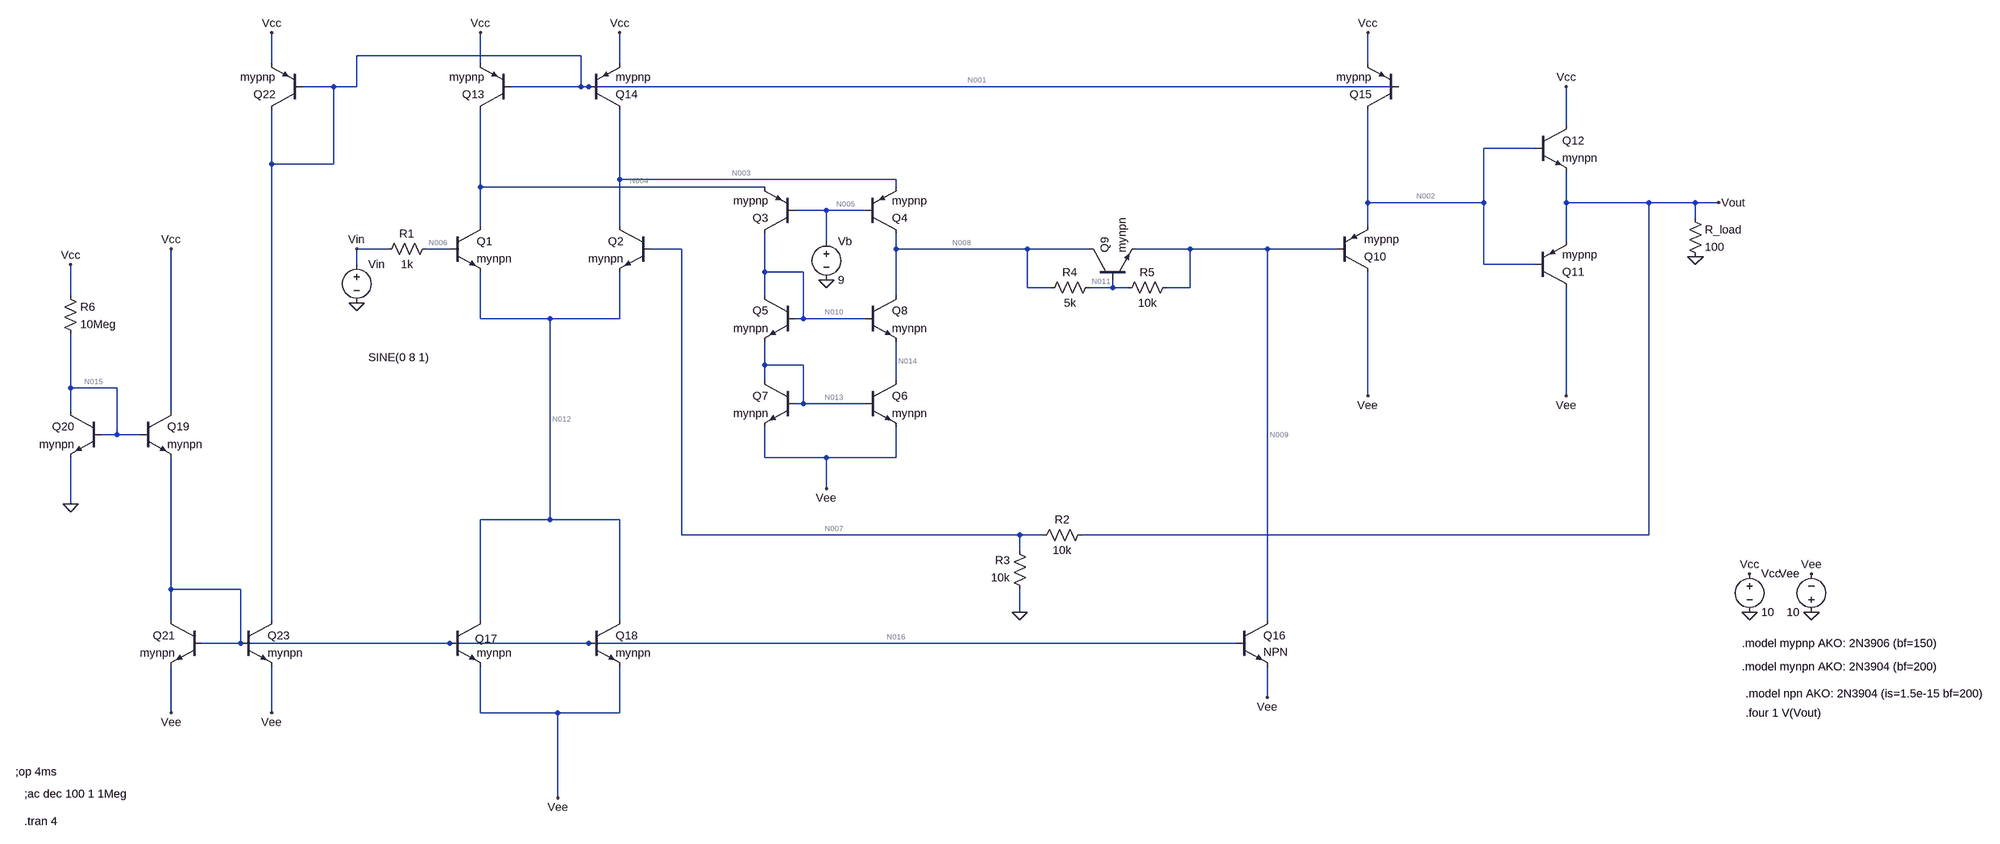
[diagram p0: schematic elec2_5.asc]
elec2_5.asc, the LTspice schematic file:
Version 4
SHEET 1 3028 1544
WIRE -48 -80 -512 -80
WIRE -688 -64 -688 -128
WIRE -256 -64 -256 -128
WIRE 32 -64 32 -128
WIRE 1648 -64 1648 -128
WIRE -560 -16 -624 -16
WIRE -512 -16 -512 -80
WIRE -512 -16 -560 -16
WIRE -48 -16 -48 -80
WIRE -48 -16 -192 -16
WIRE -32 -16 -48 -16
WIRE 1712 -16 -32 -16
WIRE 2112 64 2112 -16
WIRE 2048 112 1888 112
WIRE -688 144 -688 32
WIRE -560 144 -560 -16
WIRE -560 144 -688 144
WIRE 32 176 32 32
WIRE 672 176 32 176
WIRE -256 192 -256 32
WIRE 400 192 -256 192
WIRE 672 192 672 176
WIRE 1648 224 1648 32
WIRE 1888 224 1888 112
WIRE 1888 224 1648 224
WIRE 2112 224 2112 160
WIRE 2288 224 2112 224
WIRE 2384 224 2288 224
WIRE 2432 224 2384 224
WIRE 528 240 464 240
WIRE 608 240 528 240
WIRE 2384 256 2384 224
WIRE -256 272 -256 192
WIRE 32 272 32 176
WIRE 1648 272 1648 224
WIRE 528 304 528 240
WIRE 2112 304 2112 224
WIRE -448 320 -512 320
WIRE -320 320 -368 320
WIRE 160 320 96 320
WIRE 672 320 672 288
WIRE 944 320 672 320
WIRE 1072 320 944 320
WIRE 1280 320 1168 320
WIRE 1440 320 1280 320
WIRE 1584 320 1440 320
WIRE -512 352 -512 320
WIRE 1888 352 1888 224
WIRE 2048 352 1888 352
WIRE 400 368 400 288
WIRE 480 368 400 368
WIRE 944 400 944 320
WIRE 992 400 944 400
WIRE 1120 400 1120 384
WIRE 1120 400 1072 400
WIRE 1152 400 1120 400
WIRE 1280 400 1280 320
WIRE 1280 400 1232 400
WIRE -1104 416 -1104 352
WIRE 400 416 400 368
WIRE 672 416 672 320
WIRE -256 464 -256 368
WIRE -112 464 -256 464
WIRE 32 464 32 368
WIRE 32 464 -112 464
WIRE 480 464 480 368
WIRE 480 464 464 464
WIRE 608 464 480 464
WIRE 400 560 400 512
WIRE 480 560 400 560
WIRE 400 592 400 560
WIRE 672 592 672 512
WIRE -1104 608 -1104 496
WIRE -1008 608 -1104 608
WIRE 1648 624 1648 368
WIRE 2112 624 2112 400
WIRE 480 640 480 560
WIRE 480 640 464 640
WIRE 608 640 480 640
WIRE -1104 656 -1104 608
WIRE -896 656 -896 320
WIRE -1008 704 -1008 608
WIRE -1008 704 -1040 704
WIRE -960 704 -1008 704
WIRE 400 752 400 688
WIRE 528 752 400 752
WIRE 672 752 672 688
WIRE 672 752 528 752
WIRE 528 816 528 752
WIRE -1104 848 -1104 752
WIRE -112 880 -112 464
WIRE -112 880 -256 880
WIRE 32 880 -112 880
WIRE 160 912 160 320
WIRE 928 912 160 912
WIRE 976 912 928 912
WIRE 2288 912 2288 224
WIRE 2288 912 1056 912
WIRE 928 944 928 912
WIRE -896 1024 -896 752
WIRE -752 1024 -896 1024
WIRE 928 1072 928 1024
WIRE -896 1088 -896 1024
WIRE -688 1088 -688 144
WIRE -256 1088 -256 880
WIRE 32 1088 32 880
WIRE 1440 1088 1440 320
WIRE -752 1136 -752 1024
WIRE -752 1136 -832 1136
WIRE -320 1136 -752 1136
WIRE -32 1136 -320 1136
WIRE 1376 1136 -32 1136
WIRE 1440 1248 1440 1184
WIRE -896 1280 -896 1184
WIRE -688 1280 -688 1184
WIRE -256 1280 -256 1184
WIRE -96 1280 -256 1280
WIRE 32 1280 32 1184
WIRE 32 1280 -96 1280
WIRE -96 1456 -96 1280
FLAG 2496 1072 0
FLAG 2496 992 Vcc
FLAG -256 -128 Vcc
FLAG 32 -128 Vcc
FLAG 2624 1072 0
FLAG 2624 992 Vee
FLAG -96 1456 Vee
FLAG 528 384 0
FLAG 528 816 Vee
FLAG -512 432 0
FLAG 928 1072 0
FLAG 2112 624 Vee
FLAG 2112 -16 Vcc
FLAG 2384 336 0
FLAG 2432 224 Vout
FLAG 1648 624 Vee
FLAG 1648 -128 Vcc
FLAG 1440 1248 Vee
FLAG -896 1280 Vee
FLAG -688 -128 Vcc
FLAG -512 320 Vin
FLAG -688 1280 Vee
FLAG -1104 848 0
FLAG -896 320 Vcc
FLAG -1104 352 Vcc
SYMBOL voltage 2496 976 R0
WINDOW 123 0 0 Left 0
WINDOW 39 0 0 Left 0
SYMATTR InstName Vcc
SYMATTR Value 10
SYMBOL voltage -512 336 R0
WINDOW 3 24 208 Left 2
WINDOW 123 24 180 Left 2
WINDOW 39 0 0 Left 0
SYMATTR InstName Vin
SYMATTR Value SINE(0 8 1)
SYMBOL npn -320 272 R0
SYMATTR InstName Q1
SYMATTR Value mynpn
SYMBOL npn 96 272 M0
SYMATTR InstName Q2
SYMATTR Value mynpn
SYMBOL voltage 2624 1088 R180
WINDOW 0 24 96 Left 2
WINDOW 3 24 16 Left 2
WINDOW 123 0 0 Left 0
WINDOW 39 0 0 Left 0
SYMATTR InstName Vee
SYMATTR Value 10
SYMBOL pnp 464 288 R180
SYMATTR InstName Q3
SYMATTR Value mypnp
SYMBOL pnp 608 288 M180
SYMATTR InstName Q4
SYMATTR Value mypnp
SYMBOL voltage 528 288 R0
WINDOW 123 0 0 Left 0
WINDOW 39 0 0 Left 0
SYMATTR InstName Vb
SYMATTR Value 9
SYMBOL npn 464 416 M0
SYMATTR InstName Q5
SYMATTR Value mynpn
SYMBOL npn 608 592 R0
SYMATTR InstName Q6
SYMATTR Value mynpn
SYMBOL npn 464 592 M0
SYMATTR InstName Q7
SYMATTR Value mynpn
SYMBOL res -352 304 R90
WINDOW 0 0 56 VBottom 2
WINDOW 3 32 56 VTop 2
SYMATTR InstName R1
SYMATTR Value 1k
SYMBOL npn 608 416 R0
SYMATTR InstName Q8
SYMATTR Value mynpn
SYMBOL res 1072 896 R90
WINDOW 0 0 56 VBottom 2
WINDOW 3 32 56 VTop 2
SYMATTR InstName R2
SYMATTR Value 10k
SYMBOL res 944 1040 R180
WINDOW 0 36 76 Left 2
WINDOW 3 36 40 Left 2
SYMATTR InstName R3
SYMATTR Value 10k
SYMBOL res 1088 384 R90
WINDOW 0 0 56 VBottom 2
WINDOW 3 32 56 VTop 2
SYMATTR InstName R4
SYMATTR Value 5k
SYMBOL res 1248 384 R90
WINDOW 0 0 56 VBottom 2
WINDOW 3 32 56 VTop 2
SYMATTR InstName R5
SYMATTR Value 10k
SYMBOL npn 1072 384 R270
SYMATTR InstName Q9
SYMATTR Value mynpn
SYMBOL pnp 1584 368 M180
SYMATTR InstName Q10
SYMATTR Value mypnp
SYMBOL pnp 2048 400 M180
SYMATTR InstName Q11
SYMATTR Value mypnp
SYMBOL npn 2048 64 R0
SYMATTR InstName Q12
SYMATTR Value mynpn
SYMBOL res 2368 240 R0
SYMATTR InstName R_load
SYMATTR Value 100
SYMBOL pnp -192 32 R180
SYMATTR InstName Q13
SYMATTR Value mypnp
SYMBOL pnp -32 32 M180
SYMATTR InstName Q14
SYMATTR Value mypnp
SYMBOL pnp 1712 32 R180
SYMATTR InstName Q15
SYMATTR Value mypnp
SYMBOL npn 1376 1088 R0
WINDOW 3 56 66 Left 2
SYMATTR InstName Q16
SYMBOL npn -320 1088 R0
WINDOW 0 53 39 Left 2
SYMATTR InstName Q17
SYMATTR Value mynpn
SYMBOL npn -832 1088 M0
SYMATTR InstName Q21
SYMATTR Value mynpn
SYMBOL pnp -624 32 R180
SYMATTR InstName Q22
SYMATTR Value mypnp
SYMBOL npn -752 1088 R0
SYMATTR InstName Q23
SYMATTR Value mynpn
SYMBOL npn -32 1088 R0
SYMATTR InstName Q18
SYMATTR Value mynpn
SYMBOL res -1120 400 R0
SYMATTR InstName R6
SYMATTR Value 10Meg
SYMBOL npn -960 656 R0
SYMATTR InstName Q19
SYMATTR Value mynpn
SYMBOL npn -1040 656 M0
SYMATTR InstName Q20
SYMATTR Value mynpn
TEXT 2480 1136 Left 2 !.model mypnp AKO: 2N3906 (bf=150)
TEXT 2480 1184 Left 2 !.model mynpn AKO: 2N3904 (bf=200)
TEXT -1218 1402 Left 2 !;op 4ms
TEXT -1200 1448 Left 2 !;ac dec 100 1 1Meg
TEXT -1200 1504 Left 2 !.tran 4
TEXT 2488 1240 Left 2 !.model npn AKO: 2N3904 (is=1.5e-15 bf=200)
TEXT 2488 1280 Left 2 !.four 1 V(Vout)

The netlist it stands for:
* elec2_5.asc
Vcc Vcc 0 10
Vin Vin 0 SINE(0 8 1)
Q1 N004 N006 N012 0 mynpn
Q2 N003 N007 N012 0 mynpn
Vee 0 Vee 10
Q3 N010 N005 N004 0 mypnp
Q4 N008 N005 N003 0 mypnp
Vb N005 0 9
Q5 N010 N010 N013 0 mynpn
Q6 N014 N013 Vee 0 mynpn
Q7 N013 N013 Vee 0 mynpn
R1 N006 Vin 1k
Q8 N008 N010 N014 0 mynpn
R2 Vout N007 10k
R3 0 N007 10k
R4 N011 N008 5k
R5 N009 N011 10k
Q9 N008 N011 N009 0 mynpn
Q10 Vee N009 N002 0 mypnp
Q11 Vee N002 Vout 0 mypnp
Q12 Vcc N002 Vout 0 mynpn
R_load Vout 0 100
Q13 N004 N001 Vcc 0 mypnp
Q14 N003 N001 Vcc 0 mypnp
Q15 N002 N001 Vcc 0 mypnp
Q16 N009 N016 Vee 0 NPN
Q17 N012 N016 Vee 0 mynpn
Q21 N016 N016 Vee 0 mynpn
Q22 N001 N001 Vcc 0 mypnp
Q23 N001 N016 Vee 0 mynpn
Q18 N012 N016 Vee 0 mynpn
R6 Vcc N015 10Meg
Q19 Vcc N015 N016 0 mynpn
Q20 N015 N015 0 0 mynpn
.model NPN NPN
.model PNP PNP
.lib standard.bjt
.model mypnp AKO: 2N3906 (bf=150)
.model mynpn AKO: 2N3904 (bf=200)
;op 4ms
;ac dec 100 1 1Meg
.tran 4
.model npn AKO: 2N3904 (is=1.5e-15 bf=200)
.four 1 V(Vout)
.backanno
.end

* Results of the author's LTspice run, read from the files saved beside the schematic
* Operating Point, zero values left out:
*   V(vcc) = 10 V
*   V(n004) = 8.259 V
*   V(n006) = -2.363 mV
*   V(n012) = -638.2 mV
*   V(n003) = 9.584 V
*   V(n007) = -6.849 mV
*   V(vee) = -10 V
*   V(n010) = -9.589 V
*   V(n005) = 9 V
*   V(n008) = 767.9 mV
*   V(n013) = -9.795 V
*   V(n014) = -9.792 V
*   V(vout) = 6.184 mV
*   V(n011) = 495.1 mV
*   V(n009) = -49.75 mV
*   V(n002) = 587.4 mV
*   V(n001) = 9.362 V
*   V(n016) = -9.366 V
*   V(n015) = -8.736 V
*   Ic(Q16) = 71.98 µA
*   Ib(Q16) = 329.3 nA
*   Ie(Q16) = -72.31 µA
*   Ic(Q22) = -505.6 µA
*   Ib(Q22) = -3.375 µA
*   Ie(Q22) = 508.9 µA
*   Ic(Q15) = -549.8 µA
*   Ib(Q15) = -3.374 µA
*   Ie(Q15) = 553.2 µA
*   Ic(Q14) = -504.4 µA
*   Ib(Q14) = -3.375 µA
*   Ie(Q14) = 507.8 µA
*   Ic(Q13) = -511.1 µA
*   Ib(Q13) = -3.375 µA
*   Ie(Q13) = 514.5 µA
*   Ic(Q11) = -10.59 pA
*   Ib(Q11) = 11.17 pA
*   Ic(Q10) = -546.2 µA
*   Ib(Q10) = -3.316 µA
*   Ie(Q10) = 549.5 µA
*   Ic(Q4) = -68.66 µA
*   Ib(Q4) = -423 nA
*   Ie(Q4) = 69.09 µA
*   Ic(Q3) = -18.6 pA
*   Ib(Q3) = 19.33 pA
*   Ib(Q20) = -8.736 pA
*   Ie(Q20) = 8.746 pA
*   Ic(Q19) = 444.5 µA
*   Ib(Q19) = 1.874 µA
*   Ie(Q19) = -446.4 µA
*   Ic(Q18) = 475.4 µA
*   Ib(Q18) = 2.189 µA
*   Ie(Q18) = -477.6 µA
*   Ic(Q23) = 519.1 µA
*   Ib(Q23) = 2.188 µA
*   Ie(Q23) = -521.2 µA
*   Ic(Q21) = 437.3 µA
*   Ib(Q21) = 2.189 µA
*   Ie(Q21) = -439.5 µA
*   Ic(Q17) = 475.4 µA
*   Ib(Q17) = 2.189 µA
*   Ie(Q17) = -477.6 µA
*   Ic(Q12) = 62.85 µA
*   Ib(Q12) = 287.3 nA
*   Ie(Q12) = -63.14 µA
*   Ic(Q9) = 14.11 µA
*   Ib(Q9) = 70.36 nA
*   Ie(Q9) = -14.18 µA
*   Ic(Q8) = 38 pA
*   Ib(Q8) = -10.03 pA
*   Ie(Q8) = -27.98 pA
*   Ic(Q7) = 27.98 pA
*   Ie(Q7) = -28.32 pA
*   Ic(Q6) = 27.98 pA
*   Ie(Q6) = -28.32 pA
*   Ic(Q5) = 28.3 pA
*   Ie(Q5) = -28.63 pA
*   Ic(Q2) = 435.4 µA
*   Ib(Q2) = 1.988 µA
*   Ie(Q2) = -437.3 µA
*   Ic(Q1) = 511.1 µA
*   Ib(Q1) = 2.363 µA
*   Ie(Q1) = -513.5 µA
*   I(R6) = 1.874 µA
*   I(R_load) = 61.84 µA
*   I(R5) = -54.48 µA
*   I(R4) = -54.55 µA
*   I(R3) = 684.9 nA
*   I(R2) = 1.303 µA
*   I(R1) = -2.363 µA
*   I(Vb) = 423 nA
*   I(Vee) = -2.534 mA
*   I(Vin) = -2.363 µA
*   I(Vcc) = -2.594 mA
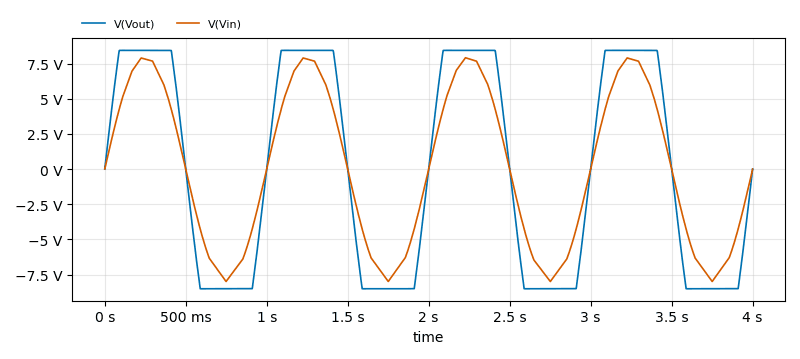
[diagram p1: Transient Analysis of elec2_5.asc, plotted from the saved traces]
* Transient Analysis, 1 run:
*   V(Vout): min -8.51 V, max 8.443 V, average -19.73 mV, rms 7.431 V, last 6.173 mV
*   V(Vin): min -7.992 V, max 7.918 V, average 31.65 mV, rms 5.567 V, last 0 V
* From the log:
*   N-Period=1
*   Fourier components of V(vout)
*   DC component:-0.0206344
*   Harmonic  Frequency   Fourier   Normalized   Phase    Normalized
*    Number     [Hz]     Component   Component  [degree]  Phase [deg]
*       1     1.000e+00  1.026e+01  1.000e+00     -0.00°      0.00°
*       2     2.000e+00  1.832e-02  1.785e-03     89.85°     89.85°
*       3     3.000e+00  2.189e+00  2.133e-01     -0.00°     -0.00°
*       4     4.000e+00  1.090e-02  1.063e-03     89.65°     89.65°
*       5     5.000e+00  3.269e-01  3.187e-02     -0.01°     -0.01°
*       6     6.000e+00  2.728e-03  2.659e-04     88.55°     88.55°
*       7     7.000e+00  2.266e-01  2.208e-02   -180.00°   -179.99°
*       8     8.000e+00  2.559e-03  2.495e-04    -88.08°    -88.08°
*       9     9.000e+00  2.067e-01  2.015e-02    180.00°    180.00°
*   Total Harmonic Distortion: 21.778345%(21.814492%)